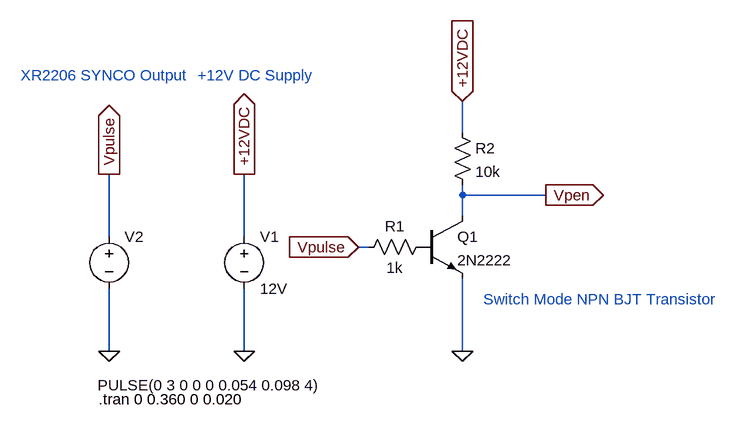
[diagram p0: schematic emulator-pen-lift-ct-sim.asc]
emulator-pen-lift-ct-sim.asc, the LTspice schematic file:
Version 4
SHEET 1 880 680
WIRE 384 -32 384 -80
WIRE 384 64 384 48
WIRE 512 64 384 64
WIRE 384 96 384 64
WIRE -160 128 -160 32
WIRE 48 128 48 32
WIRE 240 144 224 144
WIRE -160 304 -160 208
WIRE 48 304 48 208
WIRE 384 304 384 192
FLAG 48 32 +12VDC
IOPIN 48 32 Out
FLAG 48 304 0
FLAG -160 32 Vpulse
IOPIN -160 32 Out
FLAG -160 304 0
FLAG 224 144 Vpulse
IOPIN 224 144 In
FLAG 384 304 0
FLAG 384 -80 +12VDC
IOPIN 384 -80 In
FLAG 512 64 Vpen
IOPIN 512 64 Out
SYMBOL voltage 48 112 R0
SYMATTR InstName V1
SYMATTR Value 12V
SYMBOL npn 320 96 R0
SYMATTR InstName Q1
SYMATTR Value 2N2222
SYMBOL voltage -160 112 R0
WINDOW 3 -18 245 Left 2
WINDOW 123 0 0 Left 0
WINDOW 39 0 0 Left 0
SYMATTR InstName V2
SYMATTR Value PULSE(0 3 0 0 0 0.054 0.098 4)
SYMBOL res 336 128 R90
WINDOW 0 0 56 VBottom 2
WINDOW 3 32 56 VTop 2
SYMATTR InstName R1
SYMATTR Value 1k
SYMBOL res 368 -48 R0
SYMATTR InstName R2
SYMATTR Value 10k
TEXT -176 378 Left 2 !.tran 0 0.360 0 0.020
TEXT -296 -120 Left 2 ;XR2206 SYNCO Output
TEXT -24 -120 Left 2 ;+12V DC Supply
TEXT 416 224 Left 2 ;Switch Mode NPN BJT Transistor

The netlist it stands for:
* emulator-pen-lift-ct-sim.asc
V1 +12VDC 0 12V
Q1 Vpen P001 0 0 2N2222
V2 Vpulse 0 PULSE(0 3 0 0 0 0.054 0.098 4)
R1 P001 Vpulse 1k
R2 +12VDC Vpen 10k
.model NPN NPN
.model PNP PNP
.lib standard.bjt
.tran 0 0.360 0 0.020
* XR2206 SYNCO Output
* +12V DC Supply
* Switch Mode NPN BJT Transistor
.backanno
.end

* Results of the author's LTspice run, read from the files saved beside the schematic
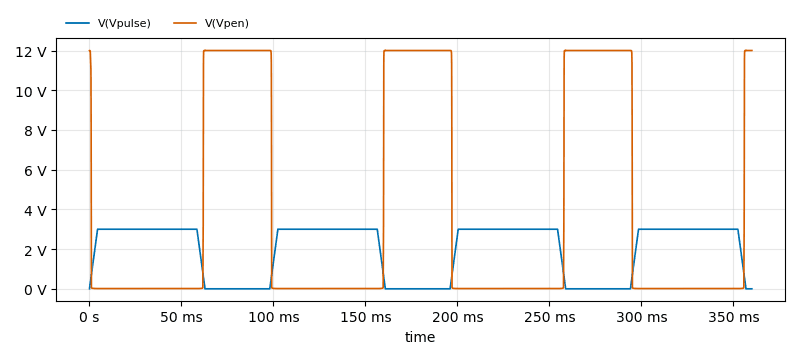
[diagram p1: Transient Analysis of emulator-pen-lift-ct-sim.asc, plotted from the saved traces]
* Transient Analysis, 1 run:
*   V(Vpulse): min 0 V, max 3 V, average 1.947 V, rms 2.387 V, last 0 V
*   V(Vpen): min 12.13 mV, max 12.01 V, average 3.887 V, rms 6.813 V, last 12 V